# Altium schematic sheet SMPS.SchDoc
size A4; SheetNumber: 2; SheetTotal: 5
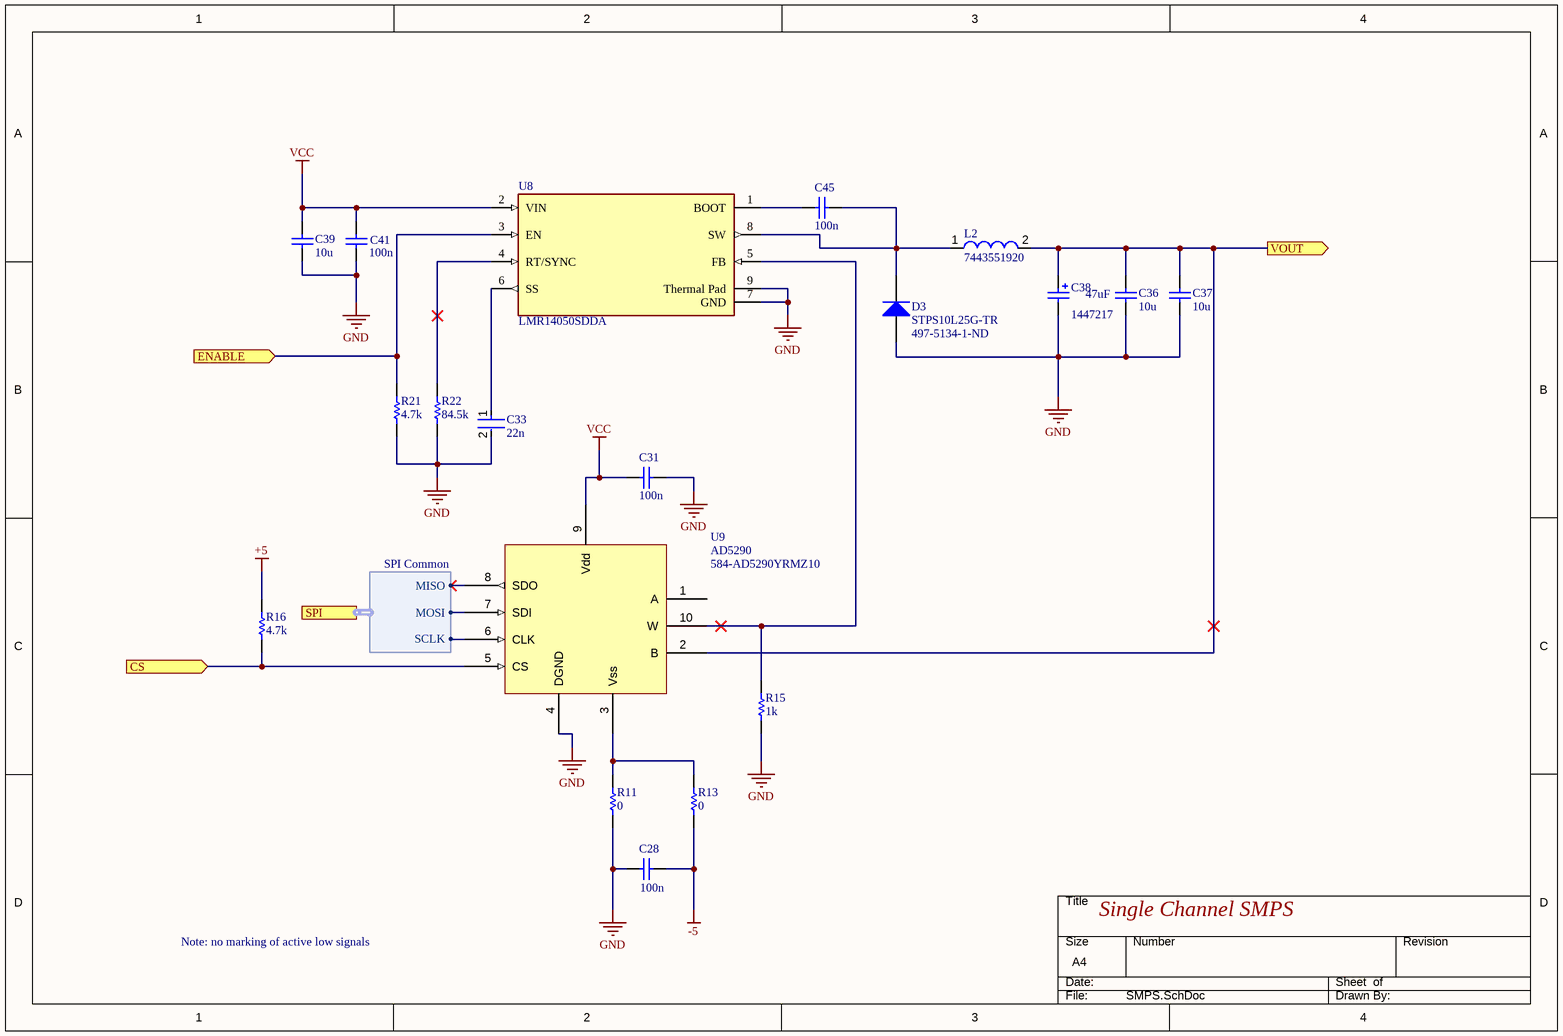
[diagram p0: SMPS.SchDoc]

## Parts
C28  100n  [CAPC2013X145X50LL20T25]
C31  100n  [CAPC2013X145X50NL20T25]
C33  22n  [FP-CC0805-0_85-MFG]
C36  10u  [CAPC3216X180X55LL20T30]
C37  10u  [CAPC3216X180X55LL20T30]
C38  Capacitance: 47uF  Supplier Part Number 1: 1447217  [7343]  (hidden comment: T521X476M035ATE030)
C39  10u  [CAPC3216X180X55LL20T30]
C41  100n  [CAPC2013X145X50LL20T25]
C45  100n  [CAPC2013X145X50LL20T25]
D3  STPS10L25G-TR  Supplier Part Number 1: 497-5134-1-ND  [D2PAK]
L2  7443551920  [WE-HCI-1365]
R11  0  [RESC2013X70X40NL20T20]
R13  0  [RESC2013X70X40NL20T20]
R15  1k  [RESC2013X50X30NL20T20]
R16  4.7k  [RESC2013X70X40ML20T20]
R21  4.7k  [RESC2013X70X40NL20T20]
R22  84.5k  [RESC2013X60X35NL10T20]
U8  LMR14050SDDA  [FP-DDA0008E-IPC_B]
U9  AD5290  Supplier Part Number 1: 584-AD5290YRMZ10  [MSOP10]

## Ports
CS (in), ENABLE (in), SPI (harness SPI Common), VOUT (out)

## Harnesses
SPI Common: MISO, MOSI, SCLK

## Nets
+5: R16.2
-5: C28.1 R13.1
GND: C28.2 C31.1 C33.2 C36.1 C37.1 C38.2 C39.1 C41.1 D3.1(A) R11.1 R15.1 R21.1 R22.1 U8.7(GND) U8.9(Thermal_Pad) U9.4(DGND)
VCC: C31.2 C39.2 C41.2 U8.2(VIN) U9.9(Vdd)
CS: R16.1 U9.5(CS) ; port CS
ENABLE: R21.2 U8.3(EN) ; port ENABLE
VOUT: C36.2 C37.2 C38.1 L2.2 U9.2(B) ; port VOUT
NetC33_1: C33.1 U8.6(SS)
NetC45_1: C45.1 D3.2(K) L2.1 U8.8(SW)
NetC45_2: C45.2 U8.1(BOOT)
NetR11_2: R11.2 R13.2 U9.3(Vss)
NetR15_2: R15.2 U8.5(FB) U9.10(W)
NetR22_2: R22.2 U8.4(RT/SYNC)
NetU9_6: U9.6(CLK) ; port SPI.SCLK
NetU9_7: U9.7(SDI) ; port SPI.MOSI
NetU9_8: U9.8(SDO) ; port SPI.MISO

Not connected (* = marked no-connect by the designer): U9 1(A)

## Notes on the sheet
- Single Channel SMPS
- Note: no marking of active low signals
- THIS DOCUMENT AND THE DATA DISCLOSED HEREIN OR
- HEREWITH IS THE PROPERTY OF ALTIUM LIMITED AND MAY
- DWG NO:
- REVISION
- REV:
- DESCRIPTION
- DATE
- APPROVED
- BE FREELY DISTRIBUTED IN WHOLE. NO RIGHTS ARE
- RESERVED OR EXPRESS OR IMPLIED WARANTEE GIVEN.
- ENG:
- APPROVALS
- PROJECT
- DSN:
- CHK:
- REFERENCE DOCUMENTS
- PROJECT REVISION:
- TITLE
- DOCUMENT REVISION:
- DESIGN ITEM:
- BOM:
- FAB DWG:
- PCB DWG:
- ASSY DWG:
- SCALE:
- A3
- SIZE
- CAGE CODE
- FILE NAME
- DWG NO.
- SHEET
- OF
- REV

## Library data of the parts
C28 C31 C41 C45 = CMP-2007-01136-1: Manufacturer: Kemet; Part Number: C0805C104K3RALTU
C33 = CMP-1036-04052-2: CAP CER 0.022UF 25V X7R 0805; Manufacturer Part Number: CC0805KRX7R8BB223; Manufacturer: Yageo; Capacitance: 22 nF; Tolerance: 0.1; Material: Ceramic; Value: 22 nF; Automotive: No; ComponentLink2Description: Datasheet; Ipc Land Pattern Name: CAPC200125X85; Height: 0.95mm; Temperature Characteristic: X7R; Lead Free: Yes; Footprint Url: http://www.yageo.com/exep/pages/download/literatures/UPY-C_GEN_24.pdf; ComponentLink2URL: http://www.yageo.com/documents/recent/UPY-GPHC_Y5V_6.3V-to-50V_8.pdf; Octopart: https://octopart.com/cc0805krx7r8bb223-yageo-42522869; Category: Cap; Package: CC0805-0.85; Digikey Description: CAP CER 0.022UF 25V X7R 0805; Temperature Range High: +85°C; Temperature: -30°C to +85°C; Voltage Rating: 25 V; Device Class L3: Ceramic Capacitors; Device Class L1: Passive Components; Device Class L2: Capacitors; RoHS: TRUE; Mouser Description: Multilayer Ceramic Capacitors MLCC - SMD/SMT 22nF 25V X7R 10%; Temperature Range Low: -30°C
C36 C37 C39 = CMP-2000-07261-1: High Value Multilayer Ceramic Capacitor, 10 uF, +/- 10%, 25 V, -55 to 125 degC, 1206 (3216 Metric), RoHS, Tape and Reel; Manufacturer: Taiyo Yuden; Catalog Drawings: xMKSeries_1206_1.6; Temperature Coefficient: X7R; Other Names: 587-2399-6; Capacitance: 10µF; Online Catalog: MSeries; Voltage - Rated: 25V; Package / Case: 1206(3216Metric); Thickness (Max): 0.071"(1.80mm); Tolerance: ±10%; Category: Capacitors; Size / Dimension: 0.126"Lx0.063"W(3.20mmx1.60mm); Lead Spacing: -; Standard Package: 1; Applications: GeneralPurpose; Features: -; Package Description: 2-Pin Surface Mount Device, Body 3.2 x 1.6 mm; Package Reference: 1206; Datasheet Version: 07/2015; Lead Style: -; Manufacturer URL: http://www.t-yuden.com/; Mounting Technology: SurfaceMount; Height - Seated (Max): -; Mounting Type: SurfaceMount,MLCC; Datasheet URL: http://datasheet.octopart.com/TMK316B7106KL-TD-Taiyo-Yuden-datasheet-62109620.pdf; Operating Temperature: -55°C~125°C; Series: M; Ratings: -; Packaging: Digi-Reel®; Family: CeramicCapacitors
C38 = T521X476M035ATE030: KEMET - T521X476M035ATE030 - CAP, TANT, POLYMER, 47UF, 35V, CASE X; pin to pad: 1>2 2>1; Tolerance: 20%; ESR (Equivalent Series Resistance): 30mR; Polarity: Polar; Life (Hours): 2000Hour; Dissipation Factor: 10%; Supplier 1: RSComponents; Manufacturer: KEMET; Manufacturer Part Number: T521X476M035ATE030; RoHS: Yes; Category: Polymer Capacitors; Stock 1: 1; Pricing 1: 500=2.79100, 1500=2.59300 (USD); Mount: Surface Mount; Case/Package: 2917; Number of Pins: 2; Case Code (Imperial): 2917; Case Code (Metric): 7343; Min Operating Temperature: -55°C; Max Operating Temperature: 125°C; Voltage Rating: 35V; Packaging: Tape and Reel; Package Quantity: 1; Voltage Rating (DC): 35V; Termination: SMD/SMT; Features: General Purpose; Series: KO-CAP T521; Construction: Flat; Length: 7.3mm; Width: 4.3mm; Height: 4mm; Height - Seated (Max): 0.169inch; Depth: 4.3mm; RoHS Compliant: Yes; REACH SVHC: No SVHC; ComponentLink1URL: https://datasheet.ciiva.com/7759/1056102-7759041.pdf?src-supplier=Element14; ComponentLink1Description: https://datasheet.ciiva.com/7759/1056102-7759041.pdf?src-supplier=Element14; ComponentLink2URL: https://datasheet.ciiva.com/262/kem-t2016-t521-262925.pdf?src-supplier=Digi-Key; ComponentLink2Description: https://datasheet.ciiva.com/262/kem-t2016-t521-262925.pdf?src-supplier=Digi-Key; ComponentLink3URL: https://datasheet.ciiva.com/262/kem-t2016-t521-262927.pdf?src-supplier=Digi-Key; ComponentLink3Description: https://datasheet.ciiva.com/262/kem-t2016-t521-262927.pdf?src-supplier=Digi-Key; ComponentLink4URL: https://datasheet.ciiva.com/22698/1899432-22698968.pdf?src-supplier=Element14; ComponentLink4Description: https://datasheet.ciiva.com/22698/1899432-22698968.pdf?src-supplier=Element14; ComponentLink5URL: https://datasheet.ciiva.com/262/kem-t2016-t521-262926.pdf?src-supplier=Digi-Key; ComponentLink5Description: https://datasheet.ciiva.com/262/kem-t2016-t521-262926.pdf?src-supplier=Digi-Key
D3 = STPS10L25G-TR: STMICROELECTRONICS   STPS10L25G-TR   DIODE, SCHOTTKY, 10A, 25V, DPAK; pin to pad: 1>3 2>4; Max Reverse Current: 800uA; Peak Non-Repetitive Surge Current: 200A; Element Configuration: Single; Forward Voltage: 550mV; Polarity: Standard; Supplier 1: Digi-Key; Manufacturer: STMicroelectronics; Manufacturer Part Number: STPS10L25G-TR; RoHS: Yes; Category: Rectifier Diodes; Stock 1: 1023; Pricing 1: 1=2.11000, 10=1.89200, 100=1.52080, 500=1.24952 (USD); Mount: Surface Mount; Case/Package: D2PAK; Number of Pins: 3; Min Operating Temperature: -65°C; Max Operating Temperature: 150°C; Forward Current: 10A; Max Repetitive Reverse Voltage (Vrrm): 25V; Max Surge Current: 200A; Package Quantity: 1; Packaging: Tape and Reel; Max Reverse Leakage Current: 800uA; Average Rectified Current: 10A; Max Forward Surge Current (Ifsm): 200A; Voltage Rating (DC): 25V; Current Rating: 10A; Output Current: 10A; Max Reverse Voltage (DC): 25V; Series: -; Radiation Hardening: No; REACH SVHC: No SVHC; Lead Free: Lead Free; RoHS Compliant: Yes; ComponentLink1URL: https://datasheet.ciiva.com/916/cd00000842-916425.pdf?src-supplier=Digi-Key; ComponentLink1Description: https://datasheet.ciiva.com/916/cd00000842-916425.pdf?src-supplier=Digi-Key; ComponentLink2URL: https://datasheet.ciiva.com/916/cd00000842-916426.pdf?src-supplier=Digi-Key; ComponentLink2Description: https://datasheet.ciiva.com/916/cd00000842-916426.pdf?src-supplier=Digi-Key; ComponentLink3URL: https://datasheet.ciiva.com/916/cd00000842-916427.pdf?src-supplier=Digi-Key; ComponentLink3Description: https://datasheet.ciiva.com/916/cd00000842-916427.pdf?src-supplier=Digi-Key; ComponentLink4URL: https://datasheet.ciiva.com/16289/cd00000842-16289051.pdf?src-supplier=Future+Electronics; ComponentLink4Description: https://datasheet.ciiva.com/16289/cd00000842-16289051.pdf?src-supplier=Future+Electronics
L2 = CMP-0226-00027-1: SMD Flat Wire High Current Inductor WE-HCI, L=9.20 µH; Inductance: 9.20 ÂµH; PackageVersion: 2008; ComponentLink2URL: http://www.we-online.de/katalog/media/pdf/7443551920.pdf; ComponentLink1URL: http://www.we-online.com; PackageReference: WE-HCI-1365; DatasheetVersion: ver 4, Jan-2008; ComponentLink1Description: Manufacturer Link; PackageDescription: Inductor, 2-Leads, Body 13.2 x 12.8 mm; ComponentLink2Description: Datasheet
R11 R13 = CMP-1665-00002-5: Chip Resistor, 0 Ohm, +/- 1%, 0.125 W, -55 to 155 degC, 0805 (2012 Metric), RoHS, Tape and Reel; PartNumber: ERJ-6GEY0R00V; Tolerance: 5%; Resistance: 0 Ohm; REACH SVHC: No SVHC; Min Operating Temperature: -55 degC; Case/Package: 0805; Packaging: Tape and Reel; Package Quantity: 5000; ComponentLink1Description: Manufacturer URL; PackageDescription: 2-Pin Surface Mount Device, Body 2 x 1.25 mm; Mounting Technology: Surface Mount; Max Operating Temperature: 155 degC; Width: 1.25 mm; RoHSCompliant: True; Height: 0.6 mm; ComponentLink1URL: http://www.panasonic.com/; ComponentLink2URL: http://industrial.panasonic.com/cdbs/www-data/pdf/RDA0000/AOA0000C84.pdf; Case Code (Imperial): 0805; DatasheetVersion: 03/2015; Length: 2 mm; Case Code (Metric): 2012; ComponentLink2Description: Datasheet; Radiation Hardening: No
R15 = CMP-1013-00510-2: Part Number: CRCW08051K00FKEA; Manufacturer: Vishay Dale
R16 R21 = CMP-2001-00420-1: Manufacturer: Panasonic; Part Number: ERJ-6GEYJ472V
R22 = CMP-2001-01285-1: Manufacturer: Yageo; Part Number: RC0805FR-0784K5L
U8 = CMP-04918-000310-1: IC REG BUCK ADJUSTABLE 5A 8SOPWR; Max Input Voltage: 40V; Quiescent Current: 40uA; Switching Frequency: 2.5MHz; Output Configuration: Positive; Max Output Voltage: 28V; Min Output Voltage: 800mV; Number of Outputs: 1; Synchronous Rectifier: No; Min Input Voltage: 4V; Output Current: 5A; Lead Free: Lead Free; Case/Package: SOIC; Min Operating Temperature: -40°C; Number of Pins: 8; Max Operating Temperature: 125°C; Packaging: Rail/Tube; RoHS Compliant: Yes; REACH SVHC: No SVHC; Output Type: Adjustable; Output Voltage: 28V; Mount: Surface Mount
U9 = AD5290: DIGIPOT 8BIT 10K, SMD, 5290, MSOP10; Manufacturer: Analog Devices; Manufacturer Part Number: AD5290YRMZ10; Resistance: 10kR; Memory Type: Volatile; Number of Positions: 256; Min Supply Voltage: 20V; Max Supply Voltage: 30V; Interface: SPI; Number of Elements: 1; Tolerance: 30%; Nominal Supply Current: 15uA; Min Dual Supply Voltage: 10V; Max Dual Supply Voltage: 15V; Temperature Coefficient: 35ppm/°C; Frequency: 4MHz; -3db Bandwidth: 470Hz; Voltage: 35V; Supplier 1: Mouser; RoHS: Yes; Category: Digital Potentiometers; Stock 1: 49; Pricing 1: 1=5.81000, 10=4.94000, 50=4.79000, 100=4.27000, 1000=4.05000, 10000=4.05000 (USD); Mount: Surface Mount; Case/Package: MSOP; Number of Pins: 10; Contact Plating: Tin,Matte; Min Operating Temperature: -40°C; Max Operating Temperature: 125°C; Packaging: Rail/Tube; Package Quantity: 50; Series: -; Taper: Linear; Number of Circuits: 1; Number of Taps: 256; Operating Supply Current: 15uA; Max Supply Current: 15uA; Supply Current: 15uA; Resistance Tolerance: 30%; Length: 3mm; Width: 3mm; Height: 0.85mm; Radiation Hardening: No; Lead Free: Contains Lead; RoHS Compliant: Yes; REACH SVHC: No SVHC; ComponentLink1URL: https://datasheet.ciiva.com/1145/1519523-1145622.pdf?src-supplier=Element14; ComponentLink1Description: https://datasheet.ciiva.com/1145/1519523-1145622.pdf?src-supplier=Element14; ComponentLink2URL: https://datasheet.ciiva.com/16471/ad5290-16471686.pdf?src-supplier=Avnet+Asia; ComponentLink2Description: https://datasheet.ciiva.com/16471/ad5290-16471686.pdf?src-supplier=Avnet+Asia; ComponentLink3URL: https://datasheet.ciiva.com/1331/ad5290-1331012.pdf?src-supplier=Digi-Key; ComponentLink3Description: https://datasheet.ciiva.com/1331/ad5290-1331012.pdf?src-supplier=Digi-Key; ComponentLink4URL: https://datasheet.ciiva.com/25918/ad5290-25918522.pdf?src-supplier=Avnet+Europe; ComponentLink4Description: https://datasheet.ciiva.com/25918/ad5290-25918522.pdf?src-supplier=Avnet+Europe; ComponentLink5URL: https://datasheet.ciiva.com/3045/ad5290-3045389.pdf?src-supplier=Avnet; ComponentLink5Description: https://datasheet.ciiva.com/3045/ad5290-3045389.pdf?src-supplier=Avnet